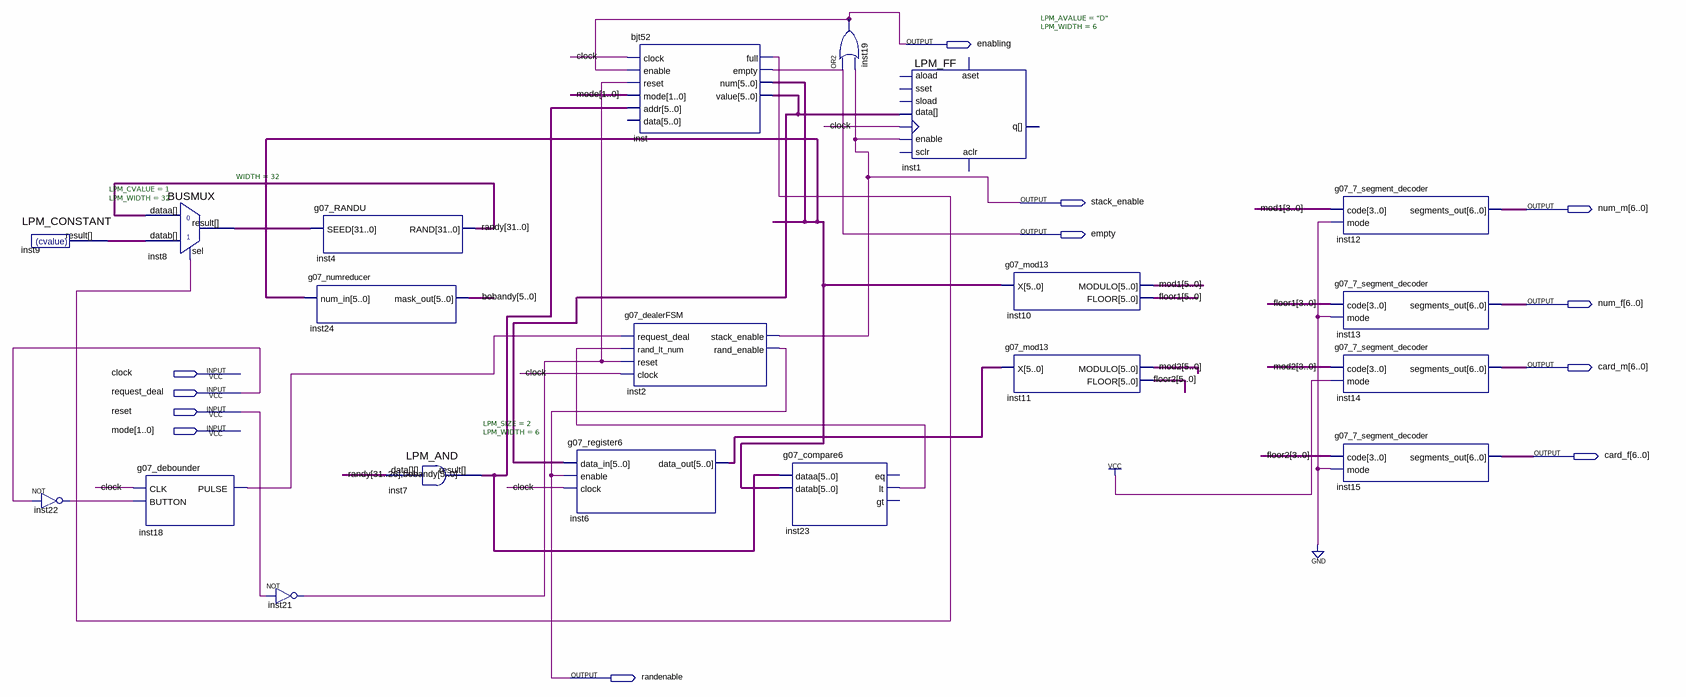
[diagram p0: schematic sheet]
// Quartus schematic dealer_testbed.bdf as structural Verilog: 20 symbols, 12 pins
module dealer_testbed (
  input  clock,
  input  request_deal,
  input  reset,
  input  [1:0] mode,
  output enabling,
  output stack_enable,
  output [6:0] num_m,
  output empty,
  output [6:0] num_f,
  output [6:0] card_m,
  output [6:0] card_f,
  output randenable
);

  wire inst18_pulse, inst21_out, inst22_out, inst23_lt, inst_full;
  wire [5:0] bobandy, floor1, floor2, inst6_data_out, inst7_result, inst_num, inst_value, mod1, mod2;
  wire [31:0] inst8_result, inst9_result, randy;

  LPM_CONSTANT #(.LPM_CVALUE(1), .LPM_WIDTH(32)) inst9 (.result(inst9_result));
  not inst22 (inst22_out, request_deal);
  BUSMUX #(.WIDTH(32)) inst8 (.datab(inst9_result), .sel(inst_full), .dataa(randy), .result(inst8_result));
  g07_debounder inst18 (.CLK(clock), .BUTTON(inst22_out), .PULSE(inst18_pulse));
  not inst21 (inst21_out, reset);
  g07_RANDU inst4 (.SEED(inst8_result), .RAND(randy));
  g07_numreducer inst24 (.num_in(inst_num), .mask_out(bobandy));
  LPM_AND #(.LPM_SIZE(2), .LPM_WIDTH(6)) inst7 (.data({randy[31:26], bobandy}), .result(inst7_result));
  g07_register6 inst6 (.data_in(inst_value), .enable(randenable), .clock(clock), .data_out(inst6_data_out));
  bjt52 inst (
    .clock(clock), .enable(enabling), .reset(inst21_out), .mode(mode), .addr(inst7_result), .full(inst_full),
    .empty(empty), .num(inst_num), .value(inst_value));  // open: data
  g07_dealerFSM inst2 (
    .request_deal(inst18_pulse), .rand_lt_num(inst23_lt), .reset(inst21_out), .clock(clock),
    .stack_enable(stack_enable), .rand_enable(randenable));
  g07_compare6 inst23 (.dataa(inst7_result), .datab(inst_num), .lt(inst23_lt));  // open: eq, gt
  or inst19 (enabling, empty, stack_enable);
  LPM_FF #(.LPM_AVALUE("D"), .LPM_WIDTH(6)) inst1 (
    .enable(stack_enable), .clock(clock), .data(inst_value));  // open: aload, sset, sload, aset, sclr, aclr, q
  g07_mod13 inst10 (.X(inst_num), .MODULO(mod1), .FLOOR(floor1));
  g07_mod13 inst11 (.X(inst6_data_out), .MODULO(mod2), .FLOOR(floor2));
  g07_7_segment_decoder inst12 (.code(mod1[3:0]), .mode(1'b0), .segments_out(num_m));
  g07_7_segment_decoder inst13 (.code(floor1[3:0]), .mode(1'b0), .segments_out(num_f));
  g07_7_segment_decoder inst14 (.code(mod2[3:0]), .mode(1'b1), .segments_out(card_m));
  g07_7_segment_decoder inst15 (.code(floor2[3:0]), .mode(1'b0), .segments_out(card_f));
endmodule
